# Altium schematic sheet FPGA_PWR.SchDoc
size A3; SheetNumber: 6; SheetTotal: 15
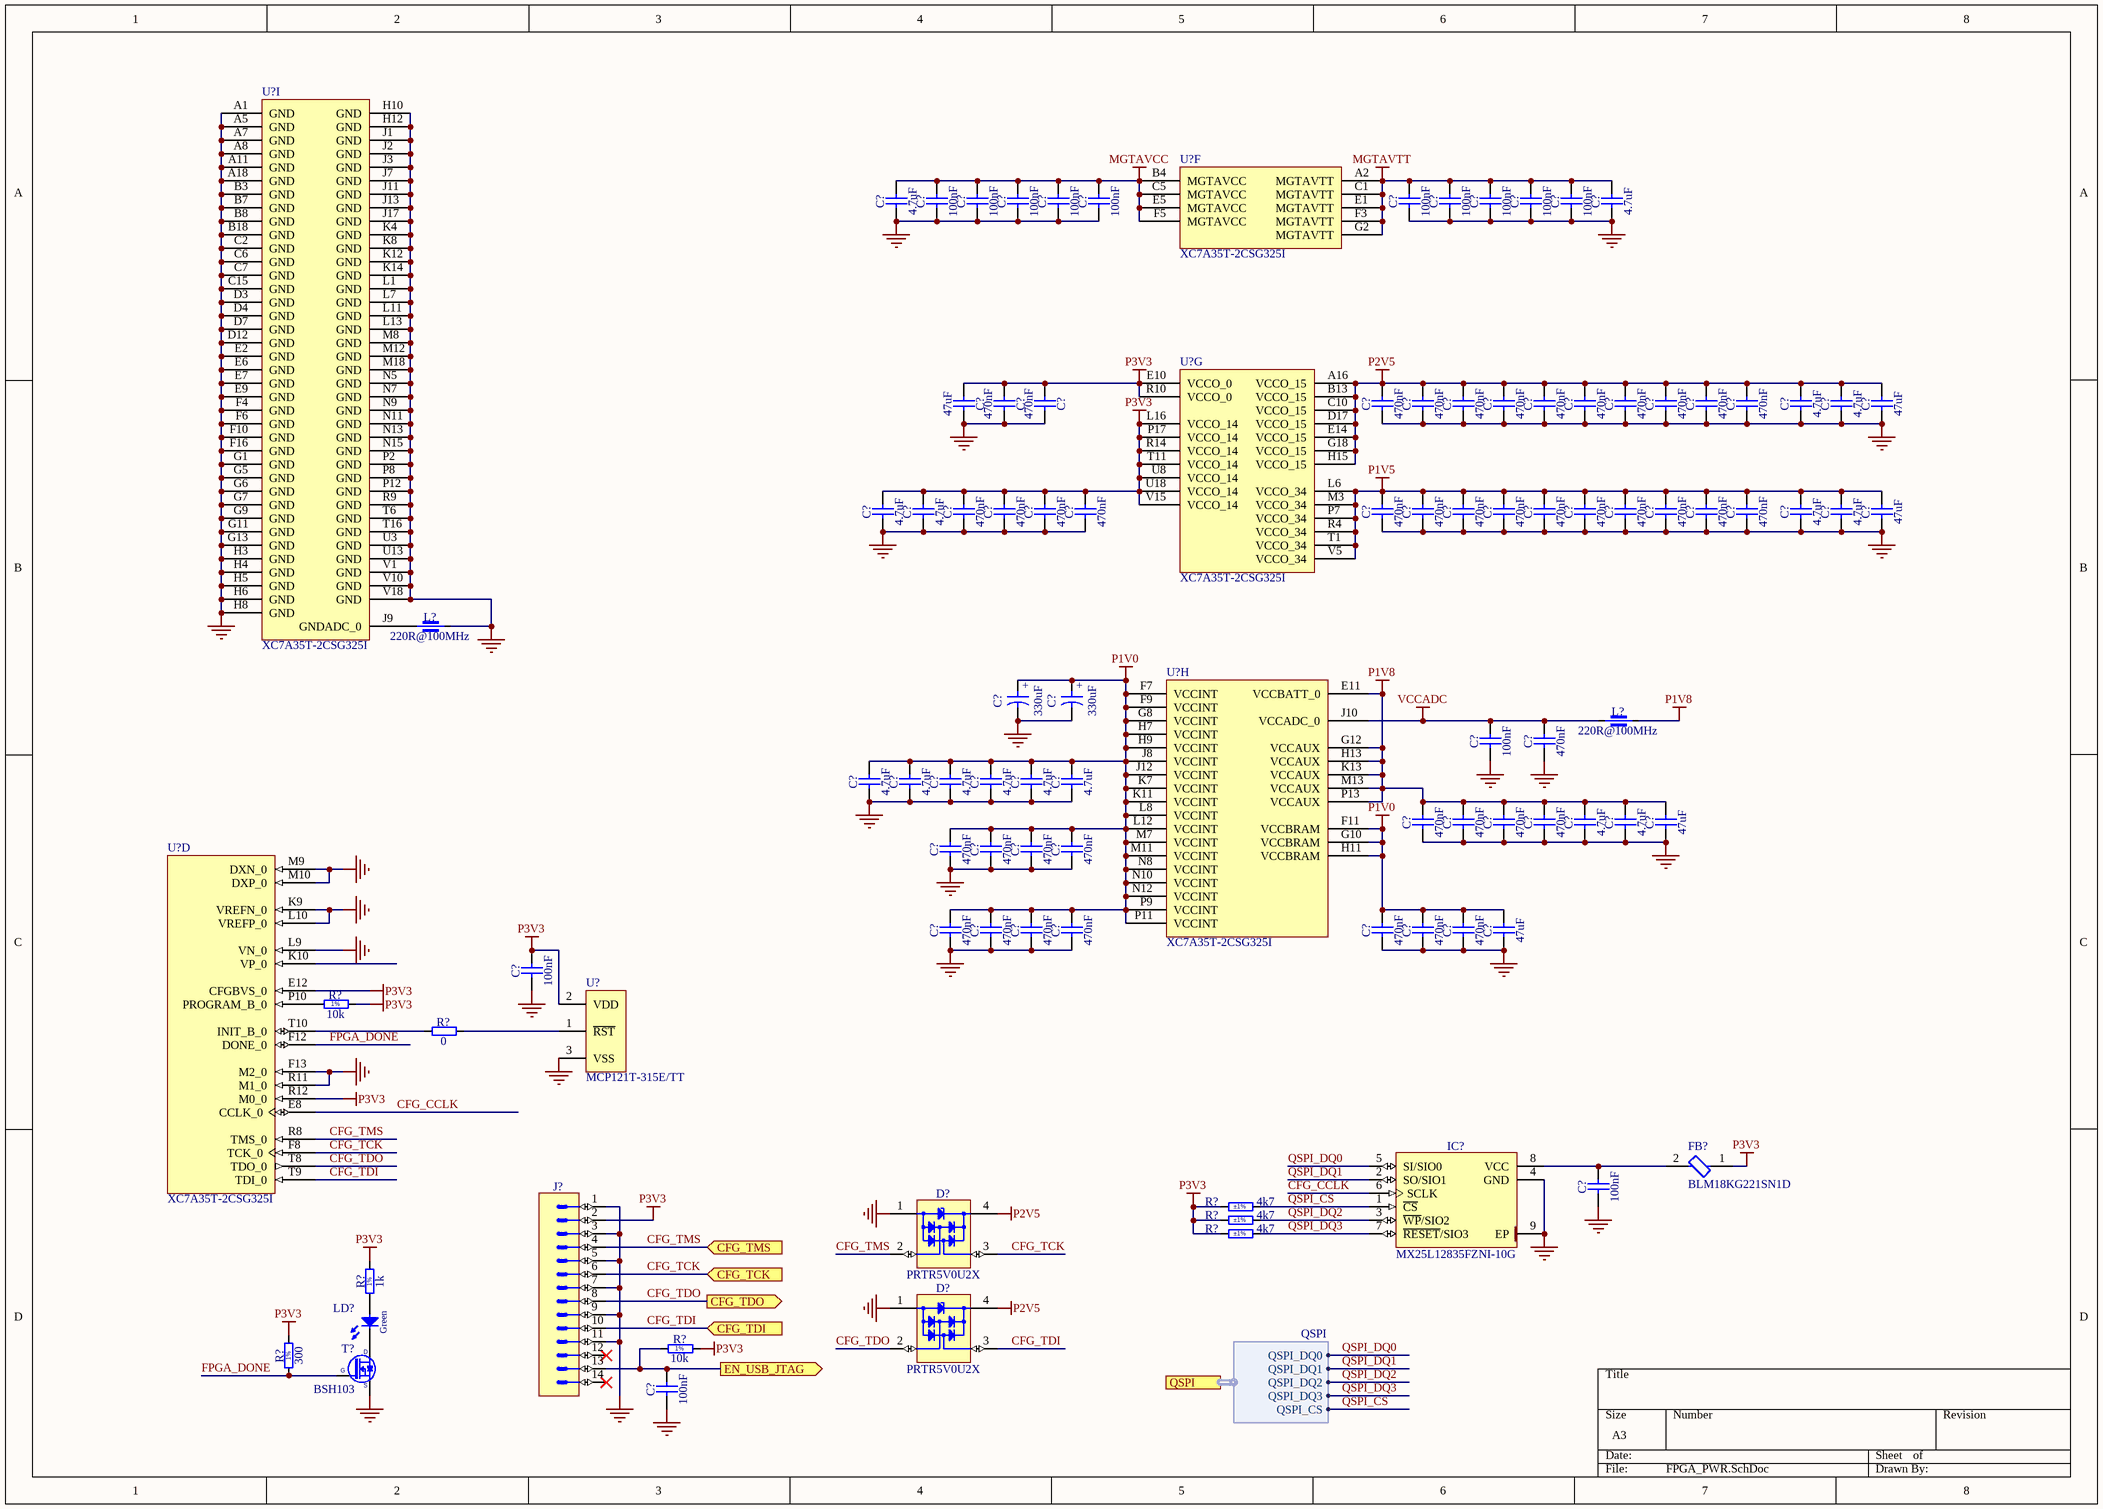
[diagram p0: FPGA_PWR.SchDoc]

## Parts
(Parts that share a designator on the sheet are numbered #1, #2 ... from top to bottom, then left to right.)
C?#1  4.7uF  [CAPC1005X55N]
C?#2  100nF  [CAPC0603X33N]
C?#3  100nF  [CAPC0603X33N]
C?#4  100nF  [CAPC0603X33N]
C?#5  100nF  [CAPC0603X33N]
C?#6  100nF  [CAPC0603X33N]
C?#7  100nF  [CAPC0603X33N]
C?#8  100nF  [CAPC0603X33N]
C?#9  100nF  [CAPC0603X33N]
C?#10  100nF  [CAPC0603X33N]
C?#11  100nF  [CAPC0603X33N]
C?#12  4.7uF  [CAPC1005X55N]
C?#13  47uF  [CAPC1608X100N]
C?#14  470nF  [CAPC0603X33N]
C?#15  470nF  [CAPC0603X33N]
C?#16  470nF  [CAPC0603X33N]
C?#17  470nF  [CAPC0603X33N]
C?#18  470nF  [CAPC0603X33N]
C?#19  470nF  [CAPC0603X33N]
C?#20  470nF  [CAPC0603X33N]
C?#21  470nF  [CAPC0603X33N]
C?#22  470nF  [CAPC0603X33N]
C?#23  470nF  [CAPC0603X33N]
C?#24  470nF  [CAPC0603X33N]
C?#25  470nF  [CAPC0603X33N]
C?#26  4.7uF  [CAPC1005X55N]
C?#27  4.7uF  [CAPC1005X55N]
C?#28  47uF  [CAPC1608X100N]
C?#29  4.7uF  [CAPC1005X55N]
C?#30  4.7uF  [CAPC1005X55N]
C?#31  470nF  [CAPC0603X33N]
C?#32  470nF  [CAPC0603X33N]
C?#33  470nF  [CAPC0603X33N]
C?#34  470nF  [CAPC0603X33N]
C?#35  470nF  [CAPC0603X33N]
C?#36  470nF  [CAPC0603X33N]
C?#37  470nF  [CAPC0603X33N]
C?#38  470nF  [CAPC0603X33N]
C?#39  470nF  [CAPC0603X33N]
C?#40  470nF  [CAPC0603X33N]
C?#41  470nF  [CAPC0603X33N]
C?#42  470nF  [CAPC0603X33N]
C?#43  470nF  [CAPC0603X33N]
C?#44  470nF  [CAPC0603X33N]
C?#45  4.7uF  [CAPC1005X55N]
C?#46  4.7uF  [CAPC1005X55N]
C?#47  47uF  [CAPC1608X100N]
C?#48  330uF  [CAPMP7343X190N]
C?#49  330uF  [CAPMP7343X190N]
C?#50  100nF  [CAPC0603X33N]
C?#51  470nF  [CAPC0603X33N]
C?#52  4.7uF  [CAPC1005X55N]
C?#53  4.7uF  [CAPC1005X55N]
C?#54  4.7uF  [CAPC1005X55N]
C?#55  4.7uF  [CAPC1005X55N]
C?#56  4.7uF  [CAPC1005X55N]
C?#57  4.7uF  [CAPC1005X55N]
C?#58  470nF  [CAPC0603X33N]
C?#59  470nF  [CAPC0603X33N]
C?#60  470nF  [CAPC0603X33N]
C?#61  470nF  [CAPC0603X33N]
C?#62  4.7uF  [CAPC1005X55N]
C?#63  4.7uF  [CAPC1005X55N]
C?#64  47uF  [CAPC1608X100N]
C?#65  470nF  [CAPC0603X33N]
C?#66  470nF  [CAPC0603X33N]
C?#67  470nF  [CAPC0603X33N]
C?#68  470nF  [CAPC0603X33N]
C?#69  470nF  [CAPC0603X33N]
C?#70  470nF  [CAPC0603X33N]
C?#71  470nF  [CAPC0603X33N]
C?#72  470nF  [CAPC0603X33N]
C?#73  470nF  [CAPC0603X33N]
C?#74  470nF  [CAPC0603X33N]
C?#75  470nF  [CAPC0603X33N]
C?#76  47uF  [CAPC1608X100N]
C?#77  100nF  [CAPC0603X33N]
C?#78  100nF  [CAPC0603X33N]
C?#79  100nF  [CAPC0603X33N]
D?#1  PRTR5V0U2X  [SOT190P230X110-4N]
D?#2  PRTR5V0U2X  [SOT190P230X110-4N]
FB?  BLM18KG221SN1D  [FP-BLM18-0_15-t0_8-IPC_B]
IC?  MX25L12835FZNI-10G  [SON127P600X500X80-9N-R350X410]
J?  Milli-Grid™  [MOLEX_87832-1420]  (value not drawn)
L?#1  220R@100MHz  [INDC1005X55N]
L?#2  220R@100MHz  [INDC1005X55N]
LD?  Green  [LED_KINGBRIGHT_KPH-1608CGCK]
R?#1  10k  [RESC1005X40N]
R?#2  0  [RESC1005X40N]
R?#3  4k7  Tolerance: ±1%  [RESC1005X40N]
R?#4  4k7  Tolerance: ±1%  [RESC1005X40N]
R?#5  4k7  Tolerance: ±1%  [RESC1005X40N]
R?#6  1k  [RESC1005X40N]
R?#7  10k  [RESC1005X40N]
R?#8  300  [RESC1005X40N]
T?  BSH103  [SOT95P230X110-3N]
U?#1  XC7A35T-2CSG325I  [CSG325]  (part I of 9)
U?#2  XC7A35T-2CSG325I  [CSG325]  (part F of 9)
U?#3  XC7A35T-2CSG325I  [CSG325]  (part G of 9)
U?#4  XC7A35T-2CSG325I  [CSG325]  (part H of 9)
U?#5  MCP121T-315E/TT  [SOT-23-TT3_L]
U?#6  XC7A35T-2CSG325I  [CSG325]  (part D of 9)

## Ports
CFG_TCK (in, see SPEC-A7-TOP[2D]), CFG_TDI (in, see SPEC-A7-TOP[2D]), CFG_TDO (out, see SPEC-A7-TOP[2D]), CFG_TMS (in, see SPEC-A7-TOP[2D]), EN_USB_JTAG (out, see SPEC-A7-TOP[2D], USB_Serial_Quad[7B]), QSPI (harness QSPI, see SPEC-A7-TOP[3D], FPGA_14_15[5C])

## Harnesses
QSPI: QSPI_DQ0, QSPI_DQ1, QSPI_DQ2, QSPI_DQ3, QSPI_CS

## Nets
GND: C?#1.1 C?#2.1 C?#3.1 C?#4.1 C?#5.1 C?#6.1 C?#7.1 C?#8.1 C?#9.1 C?#10.1 C?#11.1 C?#12.1 C?#13.1 C?#14.1 C?#15.1 C?#16.1 C?#17.1 C?#18.1 C?#19.1 C?#20.1 C?#21.1 C?#22.1 C?#23.1 C?#24.1 C?#25.1 C?#26.1 C?#27.1 C?#28.1 C?#29.1 C?#30.1 C?#31.1 C?#32.1 C?#33.1 C?#34.1 C?#35.1 C?#36.1 C?#37.1 C?#38.1 C?#39.1 C?#40.1 C?#41.1 C?#42.1 C?#43.1 C?#44.1 C?#45.1 C?#46.1 C?#47.1 C?#48.2 C?#49.2 C?#50.1 C?#51.1 C?#52.1 C?#53.1 C?#54.1 C?#55.1 C?#56.1 C?#57.1 C?#58.1 C?#59.1 C?#60.1 C?#61.1 C?#62.1 C?#63.1 C?#64.1 C?#65.1 C?#66.1 C?#67.1 C?#68.1 C?#69.1 C?#70.1 C?#71.1 C?#72.1 C?#73.1 C?#74.1 C?#75.1 C?#76.1 C?#77.1 C?#78.1 C?#79.1 D?#1.1(GND) D?#2.1(GND) IC?.4(GND) IC?.9(EP) J?.1 J?.3 J?.5 J?.7 J?.9 J?.11 L?#1.2 T?.2(S) U?#1.A1(GND) U?#1.A5(GND) U?#1.A7(GND) U?#1.A8(GND) U?#1.A11(GND) U?#1.A18(GND) U?#1.B3(GND) U?#1.B7(GND) U?#1.B8(GND) U?#1.B18(GND) U?#1.C2(GND) U?#1.C6(GND) U?#1.C7(GND) U?#1.C15(GND) U?#1.D3(GND) U?#1.D4(GND) U?#1.D7(GND) U?#1.D12(GND) U?#1.E2(GND) U?#1.E6(GND) U?#1.E7(GND) U?#1.E9(GND) U?#1.F4(GND) U?#1.F6(GND) U?#1.F10(GND) U?#1.F16(GND) U?#1.G1(GND) U?#1.G5(GND) U?#1.G6(GND) U?#1.G7(GND) U?#1.G9(GND) U?#1.G11(GND) U?#1.G13(GND) U?#1.H3(GND) U?#1.H4(GND) U?#1.H5(GND) U?#1.H6(GND) U?#1.H8(GND) U?#1.H10(GND) U?#1.H12(GND) U?#1.J1(GND) U?#1.J2(GND) U?#1.J3(GND) U?#1.J7(GND) U?#1.J11(GND) U?#1.J13(GND) U?#1.J17(GND) U?#1.K4(GND) U?#1.K8(GND) U?#1.K12(GND) U?#1.K14(GND) U?#1.L1(GND) U?#1.L7(GND) U?#1.L11(GND) U?#1.L13(GND) U?#1.M8(GND) U?#1.M12(GND) U?#1.M18(GND) U?#1.N5(GND) U?#1.N7(GND) U?#1.N9(GND) U?#1.N11(GND) U?#1.N13(GND) U?#1.N15(GND) U?#1.P2(GND) U?#1.P8(GND) U?#1.P12(GND) U?#1.R9(GND) U?#1.T6(GND) U?#1.T16(GND) U?#1.U3(GND) U?#1.U13(GND) U?#1.V1(GND) U?#1.V10(GND) U?#1.V18(GND) U?#5.3(VSS) U?#6.F13(M2_0) U?#6.K9(VREFN_0) U?#6.L9(VN_0) U?#6.L10(VREFP_0) U?#6.M9(DXN_0) U?#6.M10(DXP_0) U?#6.R11(M1_0)
MGTAVCC: C?#1.2 C?#2.2 C?#3.2 C?#4.2 C?#5.2 C?#6.2 U?#2.B4(MGTAVCC) U?#2.C5(MGTAVCC) U?#2.E5(MGTAVCC) U?#2.F5(MGTAVCC)
MGTAVTT: C?#7.2 C?#8.2 C?#9.2 C?#10.2 C?#11.2 C?#12.2 U?#2.A2(MGTAVTT) U?#2.C1(MGTAVTT) U?#2.E1(MGTAVTT) U?#2.F3(MGTAVTT) U?#2.G2(MGTAVTT)
P1V0: C?#48.1 C?#49.1 C?#52.2 C?#53.2 C?#54.2 C?#55.2 C?#56.2 C?#57.2 C?#65.2 C?#66.2 C?#67.2 C?#68.2 C?#69.2 C?#70.2 C?#71.2 C?#72.2 C?#73.2 C?#74.2 C?#75.2 C?#76.2 U?#4.F7(VCCINT) U?#4.F9(VCCINT) U?#4.F11(VCCBRAM) U?#4.G8(VCCINT) U?#4.G10(VCCBRAM) U?#4.H7(VCCINT) U?#4.H9(VCCINT) U?#4.H11(VCCBRAM) U?#4.J8(VCCINT) U?#4.J12(VCCINT) U?#4.K7(VCCINT) U?#4.K11(VCCINT) U?#4.L8(VCCINT) U?#4.L12(VCCINT) U?#4.M7(VCCINT) U?#4.M11(VCCINT) U?#4.N8(VCCINT) U?#4.N10(VCCINT) U?#4.N12(VCCINT) U?#4.P9(VCCINT) U?#4.P11(VCCINT)
P1V5: C?#35.2 C?#36.2 C?#37.2 C?#38.2 C?#39.2 C?#40.2 C?#41.2 C?#42.2 C?#43.2 C?#44.2 C?#45.2 C?#46.2 C?#47.2 U?#3.L6(VCCO_34) U?#3.M3(VCCO_34) U?#3.P7(VCCO_34) U?#3.R4(VCCO_34) U?#3.T1(VCCO_34) U?#3.V5(VCCO_34)
P1V8: C?#58.2 C?#59.2 C?#60.2 C?#61.2 C?#62.2 C?#63.2 C?#64.2 L?#2.2 U?#4.E11(VCCBATT_0) U?#4.G12(VCCAUX) U?#4.H13(VCCAUX) U?#4.K13(VCCAUX) U?#4.M13(VCCAUX) U?#4.P13(VCCAUX)
P2V5: C?#16.2 C?#17.2 C?#18.2 C?#19.2 C?#20.2 C?#21.2 C?#22.2 C?#23.2 C?#24.2 C?#25.2 C?#26.2 C?#27.2 C?#28.2 D?#1.4(VCC) D?#2.4(VCC) U?#3.A16(VCCO_15) U?#3.B13(VCCO_15) U?#3.C10(VCCO_15) U?#3.D17(VCCO_15) U?#3.E14(VCCO_15) U?#3.G18(VCCO_15) U?#3.H15(VCCO_15)
P3V3: C?#13.2 C?#14.2 C?#15.2 C?#29.2 C?#30.2 C?#31.2 C?#32.2 C?#33.2 C?#34.2 C?#77.2 FB?.1 J?.2 R?#1.2 R?#3.1 R?#4.1 R?#5.1 R?#6.2 R?#7.2 R?#8.2 U?#3.E10(VCCO_0) U?#3.L16(VCCO_14) U?#3.P17(VCCO_14) U?#3.R10(VCCO_0) U?#3.R14(VCCO_14) U?#3.T11(VCCO_14) U?#3.U8(VCCO_14) U?#3.U18(VCCO_14) U?#3.V15(VCCO_14) U?#5.2(VDD) U?#6.E12(CFGBVS_0) U?#6.R12(M0_0)
VCCADC: C?#50.2 C?#51.2 L?#2.1 U?#4.J10(VCCADC_0)
CFG_CCLK: IC?.6(SCLK) U?#6.E8(CCLK_0)
CFG_TCK: D?#1.3(I/O2) J?.6 U?#6.F8(TCK_0) ; port CFG_TCK
CFG_TDI: D?#2.3(I/O2) J?.10 U?#6.T9(TDI_0) ; port CFG_TDI
CFG_TDO: D?#2.2(I/O1) J?.8 U?#6.T8(TDO_0) ; port CFG_TDO
CFG_TMS: D?#1.2(I/O1) J?.4 U?#6.R8(TMS_0) ; port CFG_TMS
EN_USB_JTAG: C?#79.2 J?.13 R?#7.1 ; port EN_USB_JTAG
FPGA_DONE: R?#8.1 T?.1(G) U?#6.F12(DONE_0)
QSPI_CS: IC?.1(~{CS}) R?#3.2 ; port QSPI.QSPI_CS
QSPI_DQ0: IC?.5(SI/SIO0) ; port QSPI.QSPI_DQ0
QSPI_DQ1: IC?.2(SO/SIO1) ; port QSPI.QSPI_DQ1
QSPI_DQ2: IC?.3(~{WP}/SIO2) R?#4.2 ; port QSPI.QSPI_DQ2
QSPI_DQ3: IC?.7(~{RESET}/SIO3) R?#5.2 ; port QSPI.QSPI_DQ3
NetC?#78_2: C?#78.2 FB?.2 IC?.8(VCC)
NetL?#1_1: L?#1.1 U?#1.J9(GNDADC_0)
NetLD?_1: LD?.1(C) T?.3(D)
NetLD?_2: LD?.2(A) R?#6.1
NetR?#1_1: R?#1.1 U?#6.P10(PROGRAM_B_0)
NetR?#2_1: R?#2.1 U?#6.T10(INIT_B_0)
NetR?#2_2: R?#2.2 U?#5.1(~{RST})

Not connected (* = marked no-connect by the designer): J? 12* 14*; U?#6 K10(VP_0)

## Notes on the sheet
- (in symbol CTE7343-19_330UF_2.5V_20%_LESR0025_KEMET_T520) +
- (in symbol R0402_1k_1%_0.0625W_100PPM) 1%
- (in symbol R0402_10K_1%_0.0625W_100PPM) 1%
- (in symbol R0402_300R_1%_0.0625W_100PPM) 1%

## Library data of the parts
C?#1 C?#12 C?#26 C?#27 C?#29 C?#30 C?#45 C?#46 C?#52-C?#57 C?#62 C?#63 = CC0402_4.7UF_6.3V_20%_X5R: Non-polarised capacitor; Part Description: SMD Multilayer Chip Ceramic Capacitor; Manufacturer: GENERIC; Manufacturer1 Part Number: C1005X5R0J475M050BC; Voltage: 6.3V; TC: X5R; Tolerance: ±20%; Part Number: CC0402_4.7UF_6.3V_20%_X5R; Component Kind: Standard; Component Type: Standard; Pin Count: 2; Value: 4.7uF; Status: Preferred; Manufacturer Part Number: CC0402_4.7UF_6.3V_20%_X5R; Case: 0402; Mounted: Yes; Socket: No; SMD: Yes; Sense: No; Manufacturer1 Example: TDK; Manufacturer1 ComponentHeight: 0.65mm; HelpURL: \\cern.ch\dfs\Applications\Altium\Datasheets\CC0402_X5R_TDK_C.pdf; Author: CERN DEM JLC; CreateDate: 03.03.2015; LatestRevisionDate: 03.03.2015
C?#2-C?#11 C?#50 C?#77-C?#79 = CC0201_100NF_6.3V_10%_X5R: Non-polarised capacitor; Part Description: SMD Multilayer Chip Ceramic Capacitor; Manufacturer: GENERIC; Manufacturer1 Part Number: 02016D104KAT2A; Voltage: 6.3V; TC: X5R; Tolerance: ±10%; Part Number: CC0201_100NF_6.3V_10%_X5R; Component Kind: Standard; Component Type: Standard; Pin Count: 2; Value: 100nF; Status: Not Recommended; Manufacturer Part Number: CC0201_100NF_6.3V_10%_X5R; Case: 0201; Mounted: Yes; Socket: No; SMD: Yes; Sense: No; Manufacturer1 Example: AVX; Manufacturer1 ComponentHeight: 0.33mm; HelpURL: \\cern.ch\dfs\Applications\Altium\Datasheets\CC0201_X5R_AVX.pdf; Author: CERN DEM JLC
  C?#2-C?#11 C?#50: CreateDate: 03.12.2007; LatestRevisionDate: 03.12.2007
  C?#77-C?#79: CreateDate: 2007-12-03; LatestRevisionDate: 2007-12-03; ClassName: FPGA_JTAG
C?#13 C?#28 C?#47 C?#64 C?#76 = CC0603_47UF_6.3V_20%_X5R: Non-polarised capacitor; Part Description: SMD Multilayer Chip Ceramic Capacitor; Manufacturer: GENERIC; Manufacturer1 Part Number: GRM188R60J476ME15D; Voltage: 6.3V; TC: X5R; Tolerance: ±20%; Part Number: CC0603_47UF_6.3V_20%_X5R; Component Kind: Standard; Component Type: Standard; Pin Count: 2; Value: 47uF; Status: None; Manufacturer Part Number: CC0603_47UF_6.3V_20%_X5R; Case: 0603; Mounted: Yes; Socket: No; SMD: Yes; Sense: No; Manufacturer1 Example: MURATA; Manufacturer1 ComponentHeight: 1mm; HelpURL: \\cern.ch\dfs\Applications\Altium\Datasheets\CC0603_MURATA_GRM188R60J476ME15D.pdf; Author: CERN DEM JLC; CreateDate: 01.02.2018; LatestRevisionDate: 01.02.2018
C?#14-C?#25 C?#31-C?#44 C?#51 C?#58-C?#61 C?#65-C?#75 = CC0201_470NF_4V_20%_X5R: Non-polarised capacitor; Part Description: SMD Multilayer Chip Ceramic Capacitor; Manufacturer: GENERIC; Manufacturer1 Part Number: AMK063BJ474MP-F; Voltage: 4V; TC: X5R; Tolerance: ±20%; Part Number: CC0201_470NF_4V_20%_X5R; Component Kind: Standard; Component Type: Standard; Pin Count: 2; Value: 470nF; Status: Not Recommended; Manufacturer Part Number: CC0201_470NF_4V_20%_X5R; Case: 0201; Mounted: Yes; Socket: No; SMD: Yes; Sense: No; Manufacturer1 Example: TAIYO YUDEN; Manufacturer1 ComponentHeight: 0.33mm; HelpURL: \\cern.ch\dfs\Applications\Altium\Datasheets\CC0201_X5R_TAIYO-YUDEN_STANDARD-CLASS2.pdf; Author: CERN DEM JLC; CreateDate: 27.05.2010; LatestRevisionDate: 27.05.2010
C?#48 C?#49 = CTE7343-19_330UF_2.5V_20%_LESR0025_KEMET_T520: Polarised capacitor; Part Description: Low ESR 0R025 Tantalum Chip Capacitor; Manufacturer: KEMET; Manufacturer Part Number: T520V337M2R5ATE025; Voltage: 2.5V; Tolerance: ±20%; Part Number: CTE7343-19_330UF_2.5V_20%_LESR0025_KEMET_T520; Component Kind: Standard; Component Type: Standard; Pin Count: 2; Value: 330uF; Status: None; Case: V; Mounted: Yes; Socket: No; SMD: Yes; Sense: No; ComponentHeight: 1.9mm; HelpURL: \\cern.ch\dfs\Applications\Altium\Datasheets\CTE-LESR_KEMET_T520.pdf; Author: CERN DEM MR; CreateDate: 23.03.2016; LatestRevisionDate: 23.03.2016
D?#1 D?#2 = PRTR5V0U2X: Ultra Low Capacitance Double Rail-to-Rail ESD Protection Diode; Part Description: Ultra Low Capacitance (1pF) Double Rail-to-Rail ESD Protection Diode (8kV); Manufacturer: NXP SEMICONDUCTORS; Voltage: 5.5V; PressFit: No; Bonding: No; Part Number: PRTR5V0U2X; Component Kind: Standard; Component Type: Standard; Device: PRTR5V0U2X; PackageDescription: SOT143B, SOT, 1.90mm Pitch; 4 Pin, 1.30mm W X 2.90mm L X 1.10mm H body, IPC Medium Density; Manufacturer Part Number: PRTR5V0U2X; Pin Count: 4; Case: SOT143B; Mounted: Yes; Socket: No; SMD: Yes; Sense: No; ComponentHeight: 1.1mm; HelpURL: \\cern.ch\dfs\Applications\Altium\Datasheets\PRTR5V0U2X.pdf; Author: CERN DEM JLC; CreateDate: 22.03.2011; LatestRevisionDate: 22.03.2011
FB? = CMP-0686-00556-7: Chip Ferrite Bead, 0603, 220Ω @ 100MHz, 0.05Ω, 25%, 2.2A; DC Resistance (DCR): 50mR; Number of Circuits: 1; Impedance: 220R; Current Rating: 2.2A; Material: Ferrite; Test Frequency: 100MHz; Depth: 0.8mm; Series: BLM18K; RoHS Compliant: Yes; Termination: SMD/SMT; Max Current Rating: 2.2A; Case Code (Metric): 1608; Radiation Hardening: No; Number of Pins: 2; Length: 1.6mm; Lead Free: Lead Free; Package Quantity: 1; Height: 0.8mm; Core Material: Ferrite; Inductor Type: FERRITE BEAD; Min Operating Temperature: -55°C; Case/Package: 0603; Case Code (Imperial): 0603; Number of Lines: 1; Packaging: Tape and Reel; REACH SVHC: No SVHC; Max Operating Temperature: 125°C; Military Standard: Not; DC Resistance-Max: 50mR; Width: 0.8mm; DC Current: 2.2A; Max DC Current: 2.2A; Tolerance: 25%; Weight: 7.1E-05oz
IC? = MX25L12835FZNI-10G: 128Mb, 3V, Serial Multi I/O Flash Memory; Part Description: 128Mb (16M x 8), 3V, CMOS MXSMIO® Serial Multi I/O Flash Memory; Manufacturer: MACRONIX; PressFit: No; Bonding: No; Part Number: MX25L12835FZNI-10G; Component Kind: Standard; Component Type: Standard; Device: MX25L12835FZNI-10G; PackageDescription: SON, 1.27mm Pitch, 8 Pin, 6.00mm W X 5.00mm L X 0.80mm H body (w/Thermal Tab  3.50 X 4.10mm), IPC Medium Density; Manufacturer Part Number: MX25L12835FZNI-10G; Pin Count: 9; Case: SON8; Mounted: Yes; Socket: No; SMD: Yes; Sense: No; ComponentHeight: 2.16mm; HelpURL: \\cern.ch\dfs\Applications\Altium\Datasheets\MX25L12835.pdf; Author: CERN DEM HF; CreateDate: 16.04.2024; LatestRevisionDate: 16.04.2024
J? = MOLEX_87832-1420: Connector 14 Male; Part Description: 2.00mm (.079") Pitch Milli-Grid™ Header, Surface Mount, Vertical, Shrouded, 14 Circuits,with Locking Windows and Centre Polarization Slot, PCB Locator; Manufacturer: MOLEX; PressFit: No; Part Number: MOLEX_87832-1420; Component Kind: Standard; Component Type: Standard; Pin Count: 14; Family: Milli-Grid™; Mounted: Yes; Socket: No; SMD: Yes; Sense: No; Status: None; Manufacturer Part Number: 87832-1420; ComponentHeight: 7.6mm; HelpURL: \\cern.ch\dfs\Applications\Altium\Datasheets\MOLEX_87832-1420.pdf; Author: CERN DEM JLC; CreateDate: 09.09.2008; LatestRevisionDate: 09.09.2008
L?#1 L?#2 = IND0402_MURATA_BLM15HB221SN1: Part Description: SMD EMIFIL Suppression Chip Ferrite Bead; Manufacturer: MURATA; Power: 250mA; Resistance: 1R; Tolerance: ±25%; Part Number: IND0402_MURATA_BLM15HB221SN1; Component Kind: Standard; Component Type: Standard; Pin Count: 2; Value: 220R@100MHz; Status: None; Manufacturer Part Number: BLM15HB221SN1; Case: 0402; Mounted: Yes; Socket: No; SMD: Yes; Sense: No; ComponentHeight: 0.55mm; HelpURL: \\cern.ch\dfs\Applications\Altium\Datasheets\IND0402_MURATA_BLM15H.pdf; Author: CERN DEM JLC; CreateDate: 23.06.2009; LatestRevisionDate: 25.10.2018
LD? = LED_KINGBRIGHT_KPH-1608CGCK: LED Green 1C 2A; Part Description: SMD Green LED, Case 1.6mmX0.8mm(0603), 0.65mm Thickness; PressFit: No; Bonding: No; Manufacturer Part Number: KPH-1608CGCK; ComponentHeight: 0.65mm; HelpURL: \\cern.ch\dfs\Applications\Altium\Datasheets\LED_KINGBRIGHT_KPH-1608CGCK.pdf; Part Number: LED_KINGBRIGHT_KPH-1608CGCK; Component Kind: Standard; Component Type: Standard; Color: Green; PackageDescription: SMT Green LED, Case 0603, Body L 1.6 x W 0.8mm H 0.65mm; Manufacturer: KINGBRIGHT; Pin Count: 2; Mounted: Yes; Socket: No; SMD: Yes; Sense: No; Author: CERN DEM JLC; CreateDate: 03.07.2017; LatestRevisionDate: 03.07.2017
R?#1 R?#7 = R0402_10K_1%_0.0625W_100PPM: Resistor - 1%; Part Description: General Purpose Thick Film Chip Resistor; Manufacturer: GENERIC; Manufacturer1 Part Number: 232270671003L; TC: ±100ppm/°C; PressFit: No; Part Number: R0402_10K_1%_0.0625W_100PPM; Component Kind: Standard; Component Type: Standard; Pin Count: 2; Value: 10k; Status: Not Recommended; Power: 0.0625W; Tolerance: ±1%; Manufacturer Part Number: R0402_10K_1%_0.0625W_100PPM; Case: 0402; Mounted: Yes; Sense: No; Socket: No; SMD: Yes; Manufacturer1 Example: YAGEO PHYCOMP; Manufacturer1 ComponentHeight: 0.4mm; HelpURL: \\cern.ch\dfs\Applications\Altium\Datasheets\R0402_Phycomp_RC0402.pdf; Author: CERN DEM JLC; CreateDate: 03.12.2007; LatestRevisionDate: 17.10.2012; ClassName: FPGA_JTAG
R?#2 = R0402_0R_JUMPER: Resistor; Part Description: 1A (0.05R Max DC Resistance) Zero Ohm Jumper; Manufacturer: GENERIC; Manufacturer1 Part Number: 232270591001L; PressFit: No; Part Number: R0402_0R_JUMPER; Component Kind: Standard; Component Type: Standard; Pin Count: 2; Value: 0; Status: Not Recommended; Manufacturer Part Number: R0402_0R_JUMPER; Case: 0402; Mounted: Yes; Sense: No; Socket: No; SMD: Yes; Manufacturer1 Example: YAGEO PHYCOMP; Manufacturer1 ComponentHeight: 0.4mm; HelpURL: \\cern.ch\dfs\Applications\Altium\Datasheets\R0402_Phycomp_RC0402.pdf; Author: CERN DEM JLC; CreateDate: 03.12.2007; LatestRevisionDate: 17.10.2012; ClassName: Artix
R?#3-R?#5 = R0402_4K7_1%_0.0625W_100PPM: Resistor - 1%; Part Description: General Purpose Thick Film Chip Resistor; Manufacturer: GENERIC; Manufacturer1 Part Number: 232270674702L; TC: ±100ppm/°C; PressFit: No; Part Number: R0402_4K7_1%_0.0625W_100PPM; Component Kind: Standard; Component Type: Standard; Pin Count: 2; Value: 4k7; Status: Not Recommended; Power: 0.0625W; Manufacturer Part Number: R0402_4K7_1%_0.0625W_100PPM; Case: 0402; Mounted: Yes; Sense: No; Socket: No; SMD: Yes; Manufacturer1 Example: YAGEO PHYCOMP; Manufacturer1 ComponentHeight: 0.4mm; HelpURL: \\cern.ch\dfs\Applications\Altium\Datasheets\R0402_Phycomp_RC0402.pdf; Author: CERN DEM JLC; CreateDate: 03.12.2007; LatestRevisionDate: 17.10.2012
R?#6 = R0402_1k_1%_0.0625W_100PPM: Resistor - 1%; Part Description: General Purpose Thick Film Chip Resistor; Manufacturer: GENERIC; Manufacturer1 Part Number: 232270671002L; TC: ±100ppm/°C; PressFit: No; Part Number: R0402_1K_1%_0.0625W_100PPM; Component Kind: Standard; Component Type: Standard; Pin Count: 2; Value: 1k; Status: Not Recommended; Power: 0.0625W; Tolerance: ±1%; Manufacturer Part Number: R0402_1K_1%_0.0625W_100PPM; Case: 0402; Mounted: Yes; Sense: No; Socket: No; SMD: Yes; Manufacturer1 Example: YAGEO PHYCOMP; Manufacturer1 ComponentHeight: 0.4mm; HelpURL: \\cern.ch\dfs\Applications\Altium\Datasheets\R0402_Phycomp_RC0402.pdf; Author: CERN DEM JLC; CreateDate: 03.12.2007; LatestRevisionDate: 17.10.2012; ClassName: Artix
R?#8 = R0402_300R_1%_0.0625W_100PPM: Resistor - 1%; Part Description: General Purpose Thick Film Chip Resistor; Manufacturer: GENERIC; Manufacturer1 Part Number: 232270673001L; TC: ±100ppm/°C; PressFit: No; Part Number: R0402_300R_1%_0.0625W_100PPM; Component Kind: Standard; Component Type: Standard; Pin Count: 2; Value: 300; Status: Not Recommended; Power: 0.0625W; Tolerance: ±1%; Manufacturer Part Number: R0402_300R_1%_0.0625W_100PPM; Case: 0402; Mounted: Yes; Sense: No; Socket: No; SMD: Yes; Manufacturer1 Example: YAGEO PHYCOMP; Manufacturer1 ComponentHeight: 0.4mm; HelpURL: \\cern.ch\dfs\Applications\Altium\Datasheets\R0402_Phycomp_RC0402.pdf; Author: CERN DEM JLC; CreateDate: 03.12.2007; LatestRevisionDate: 17.10.2012
T? = BSH103: N-CHANNEL MOSFET WITH DIODE; Part Description: 30V 850mA N-Channel Enhancement Mode Field-Effect Transistor; Manufacturer: NEXPERIA; PressFit: No; Bonding: No; Part Number: BSH103; Component Kind: Standard; Component Type: Standard; Device: BSH103; PackageDescription: SOT23, 3 pin, Pitch 0.95mm - 1.3mm W X 2.9mm L X 1.1mm H, IPC Medium Density; Manufacturer Part Number: BSH103; Pin Count: 3; Case: SOT23-3; Mounted: Yes; Socket: No; SMD: Yes; Sense: No; ComponentHeight: 1.1mm; HelpURL: \\cern.ch\dfs\Applications\Altium\Datasheets\BSH103.pdf; Author: CERN DEM JLC; CreateDate: 16.03.2010; LatestRevisionDate: 20.06.2017; ClassName: Artix
U?#1-U?#4 U?#6 = CMP-0383-00003-1: Artix-7 FPGA, 150 User I/Os, 4 GTP, 324-Ball BGA, Speed Grade 2, Industrial Grade, Pb-Free; Manufacturer: Xilinx; Available User I/O: 150; Speed Grades: 2; GTP: 4; Logic Cells: 33280; Total Block RAM: 1800 Kb; CMTs: 5; ComponentLink3URL: http://www.xilinx.com/support/documentation/user_guides/ug475_7Series_Pkg_Pinout.pdf; Maximum Distributed RAM: 400 Kb; Operating Temperature Range: Industrial; ComponentLink1URL: http://www.xilinx.com/; Mounting Technology: Surface Mount; ComponentLink1Description: Manufacturer URL; ComponentLink2Description: Datasheet; PartNumber: XC7A35T-2CSG325I; PackageVersion: Rev. 1.11; PackageDescription: 324-Ball Wire-Bond Chip-Scale BGA, Body 15 x 15 mm, Pitch 0.8 mm; DatasheetVersion: Rev. 1.15; PackageReference: CSG-325; ComponentLink3Description: Pinout; ComponentLink4Description: Package Specification; ComponentLink2URL: http://www.xilinx.com/support/documentation/data_sheets/ds180_7Series_Overview.pdf; ComponentLink4URL: http://www.xilinx.com/support/documentation/user_guides/ug475_7Series_Pkg_Pinout.pdf
U?#5 = CMP-0138-00412-1: Micropower Voltage Supervisors, 3-Pin SOT-23, Extended Temperature, Tape and Reel; PackageReference: SOT-23-TT3; PackageVersion: revBB, Aug-2009; DatasheetVersion: revB, Mar-2005; Code_IPC: SOT23-3; PackageDescription: 3-Lead Plastic Small Outline Transistor (TT) [SOT-23]